# EAGLE design LooSensorNodeV2 (EAGLE 8.7.0)

## Sheet 1 of 3
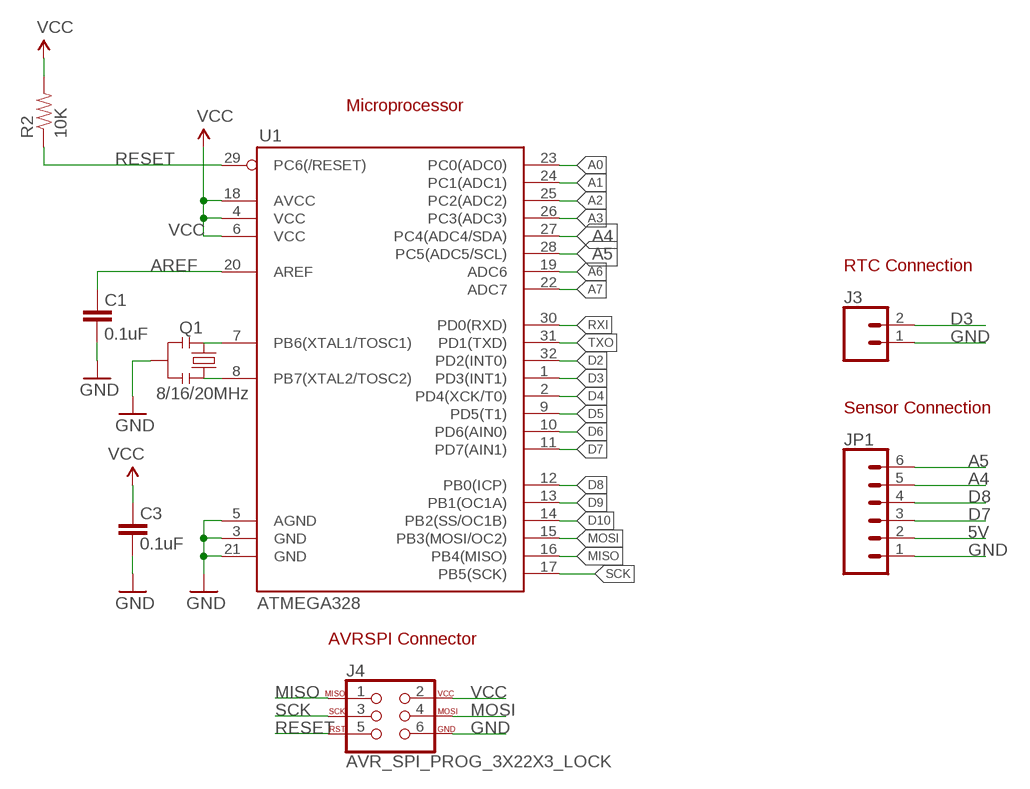
[diagram p0: schematic, sheet 1]

### Parts
C1  0.1uF  CAP0603-CAP  [0603-CAP]
C3  0.1uF  CAP0603-CAP  [0603-CAP]
J3  CONN_02  [1X02]
J4  AVR_SPI_PROG_3X22X3_LOCK  [2X3_LOCK]
JP1  CONN_06SILK_FEMALE_PTH  [1X06]
Q1  8/16/20MHz  RESONATOR1:1  [RESONATOR-SMD-1:1]
R2  10K  RESISTOR0603-RES  [0603-RES]
U1  ATMEGA328  ATMEGA168  [TQFP32-08]

### Nets
5V: JP1.2 ; also sheet 2
A0: U1.23(PC0(ADC0))
A1: U1.24(PC1(ADC1))
A2: U1.25(PC2(ADC2))
A3: U1.26(PC3(ADC3))
A4: JP1.5 U1.27(PC4(ADC4/SDA))
A5: JP1.6 U1.28(PC5(ADC5/SCL))
A6: U1.19(ADC6)
A7: U1.22(ADC7)
AREF: C1.2 U1.20(AREF)
D2: U1.32(PD2(INT0))
D3: J3.2 U1.1(PD3(INT1))
D4: U1.2(PD4(XCK/T0)) ; also sheet 3
D5: U1.9(PD5(T1))
D6: U1.10(PD6(AIN0)) ; also sheet 2
D7: JP1.3 U1.11(PD7(AIN1))
D8: JP1.4 U1.12(PB0(ICP))
D9: U1.13(PB1(OC1A))
D10: U1.14(PB2(SS/OC1B))
GND [vcc]: C1.1 C3.1 J3.1 J4.6 JP1.1 Q1.2 U1.3(GND) U1.5(AGND) U1.21(GND) ; also sheet 2,3
MISO: J4.1 U1.16(PB4(MISO))
MOSI: J4.4 U1.15(PB3(MOSI/OC2))
N$1: Q1.3 U1.8(PB7(XTAL2/TOSC2))
N$2: Q1.1 U1.7(PB6(XTAL1/TOSC1))
RESET: J4.5 R2.1 U1.29(PC6(/RESET))
RXI: U1.30(PD0(RXD)) ; also sheet 3
SCK: J4.3 U1.17(PB5(SCK))
TXO: U1.31(PD1(TXD)) ; also sheet 3
VCC: C3.2 J4.2 R2.2 U1.4(VCC) U1.6(VCC) U1.18(AVCC) ; also sheet 2

### Notes on the sheet
- Microprocessor
- RTC Connection
- Sensor Connection
- AVRSPI Connector

## Sheet 2 of 3
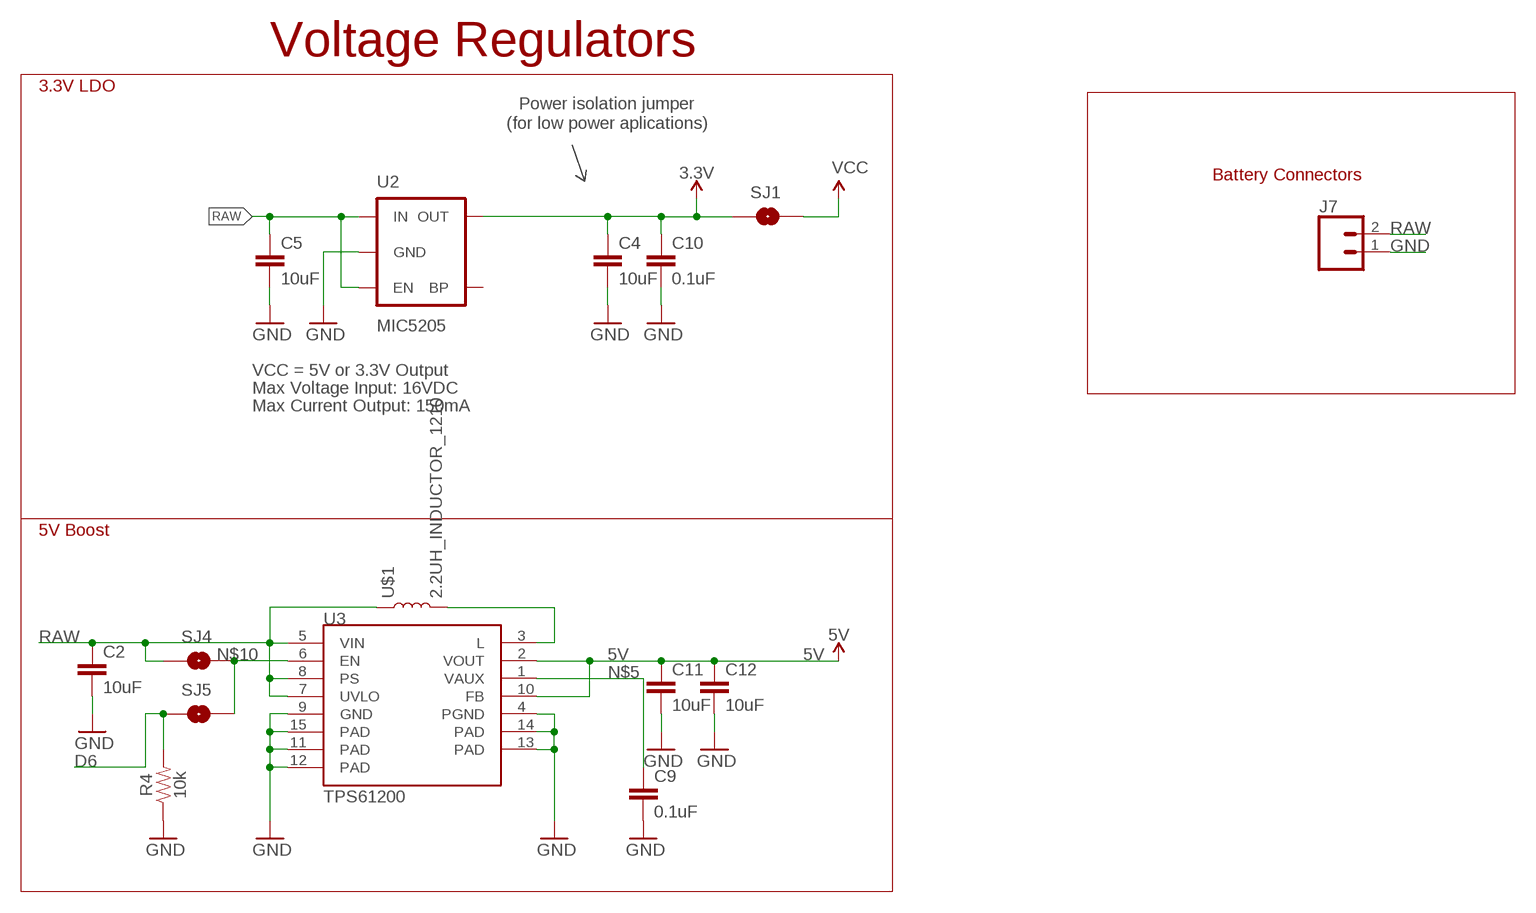
[diagram p1: schematic, sheet 2]

### Parts
C2  10uF  10UF-0603-6.3V-20%  [0603]
C4  10uF  10UF-0603-6.3V-20%  [0603]
C5  10uF  10UF-0603-6.3V-20%  [0603]
C9  0.1uF  0.1UF-0603-25V-5%  [0603]
C10  0.1uF  CAP0603-CAP  [0603-CAP]
C11  10uF  10UF-0603-6.3V-20%  [0603]
C12  10uF  10UF-0603-6.3V-20%  [0603]
J7  CONN_02  [1X02]
R4  10k  10KOHM-0603-1/10W-1%  [0603]
SJ1  SOLDERJUMPERNC  [SJ_2S]
SJ4  SOLDERJUMPERNC  [SJ_2S]
SJ5  SOLDERJUMPERNC  [SJ_2S]
U2  MIC5205  V_REG_LDOSMD  [SOT23-5]
U3  TPS61200  [QFN-10_PAD]
U$1  2.2UH_INDUCTOR_1210  [1210]

### Nets
3.3V: C4.1 C10.1 SJ1.1 U2.5(OUT) ; also sheet 3
5V: C11.1 C12.1 U3.2(VOUT) U3.10(FB) ; also sheet 1
D6: R4.2 SJ5.1 ; also sheet 1
GND [vcc]: C2.2 C4.2 C5.2 C9.2 C10.2 C11.2 C12.2 J7.1 R4.1 U2.2(GND) U3.4(PGND) U3.9(GND) U3.11(PAD) U3.12(PAD) U3.13(PAD) U3.14(PAD) U3.15(PAD) ; also sheet 1,3
N$5: C9.1 U3.1(VAUX)
N$8: U3.3(L) U$1.2
N$10: SJ4.2 SJ5.2 U3.6(EN)
RAW [vcc]: C2.1 C5.1 J7.2 SJ4.1 U2.1(IN) U2.3(EN) U3.5(VIN) U3.7(UVLO) U3.8(PS) U$1.1
VCC: SJ1.2 ; also sheet 1
Unconnected: U2.4(BP)

### Notes on the sheet
- Voltage Regulators
- 3.3V LDO
- Power isolation jumper
- (for low power aplications)
- Battery Connectors
- VCC = 5V or 3.3V Output
- Max Voltage Input: 16VDC
- Max Current Output: 150mA
- 5V Boost

## Sheet 3 of 3
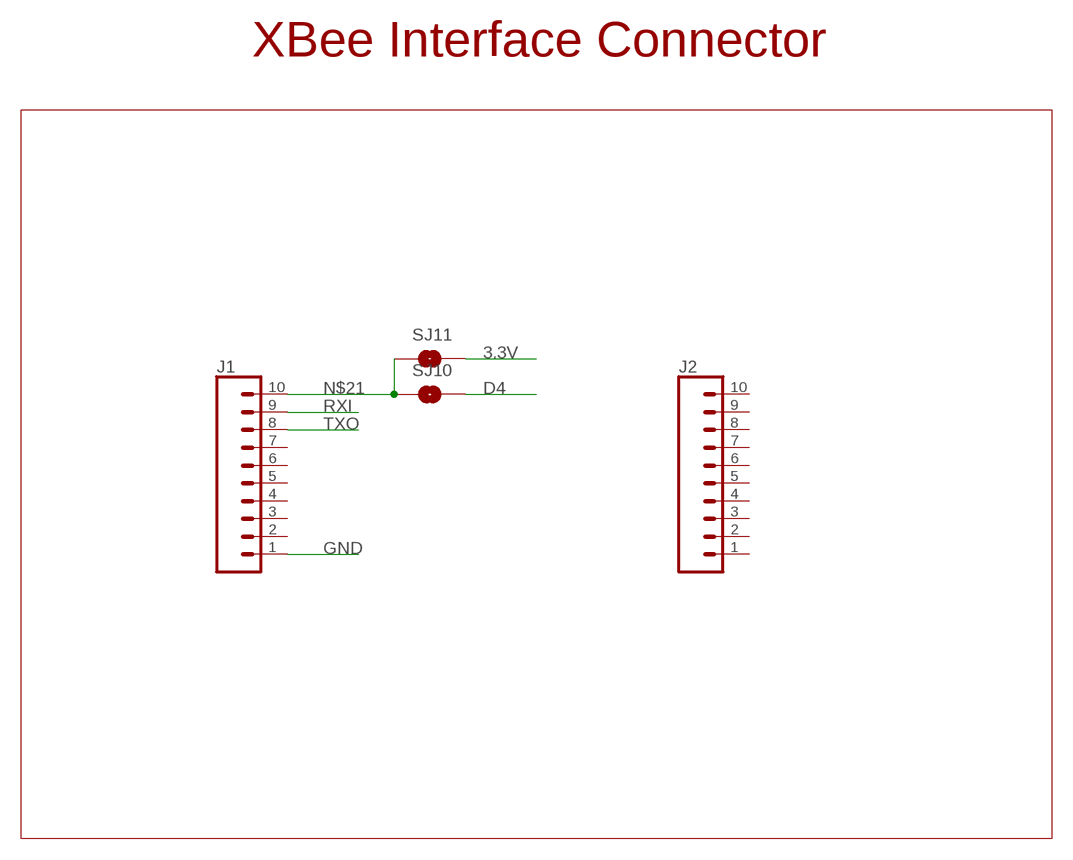
[diagram p2: schematic, sheet 3]

### Parts
J1  CONN_102MM  [1X10-2MM]
J2  CONN_102MM  [1X10-2MM]
SJ10  SOLDERJUMPERNC  [SJ_2S]
SJ11  SOLDERJUMPERNC  [SJ_2S]

### Nets
3.3V: SJ11.2 ; also sheet 2
D4: SJ10.2 ; also sheet 1
GND [vcc]: J1.1 ; also sheet 1,2
N$21: J1.10 SJ10.1 SJ11.1
RXI: J1.9 ; also sheet 1
TXO: J1.8 ; also sheet 1
Unconnected: J1.2 J1.3 J1.4 J1.5 J1.6 J1.7 J2.1 J2.2 J2.3 J2.4 J2.5 J2.6 J2.7 J2.8 J2.9 J2.10

### Notes on the sheet
- XBee Interface Connector

## Library data of the parts
C1 C3 C10 = SparkFun:CAP: Capacitor Standard 0603 ceramic capacitor, and 0.1" leaded capacitor.
C2 C4 C5 C11 C12 = SparkFun-Capacitors:10UF: 10.0µF ceramic capacitors A capacitor is a passive two-terminal electrical component used to store electrical energy temporarily in an electric field.; PROD_ID: CAP-11015
C9 = SparkFun-Capacitors:0.1UF: 0.1µF ceramic capacitors A capacitor is a passive two-terminal electrical component used to store electrical energy temporarily in an electric field.; PROD_ID: CAP-08604
J1 J2 = SparkFun-Connectors:CONN_10: Multi connection point. Often used as Generic Header-pin footprint for 0.1 inch spaced/style header connections On any of the 0.1 inch spaced packages, you can populate with these: Break Away Headers - Straight <https://www.sparkfun.com/products/116> (PRT-00116) Break Away Male Headers - Right Angle <https://www.sparkfun.com/products/553> (PRT-00553) Female Headers <https://www.sparkfun.com/products/115> (PRT-00115) Break Away Headers - Machine Pin <https://www.sparkfun.com/products/117> (PRT-00117) Break Away Female Headers - Swiss Machine Pin <https://www.sparkfun.com/products/743> (PRT-00743) Arduino Stackable Header - 10 Pin <https://www.sparkfun.com/products/11376> (PRT-11376) For SCREWTERMINALS and SPRING TERMINALS visit here: Screw Terimnals on SparkFun.com <https://www.sparkfun.com/search/results?term=Screw+Terminals> (5mm/3.5mm/2.54mm spacing) This device is also useful as a general connection point to wire up your design to another part of your project. Our various solder wires solder well into these plated through hole pads. Hook-Up Wire - Assortment (Stranded, 22 AWG) <https://www.sparkfun.com/products/11375> (PRT-11375) Hook-Up Wire - Assortment (Solid Core, 22 AWG) <https://www.sparkfun.com/products/11367> (PRT-11367) View the entire wire category on our website here <https://www.sparkfun.com/categories/141> Special notes: Molex polarized connector foot print use with SKU : PRT-08231 with associated crimp pins and housings. 1MM SMD Version SKU: PRT-10208 NOTES ON THE VARIANTS LOCK and LOCK_LONGPADS... This footprint was designed to help hold the alignment of a through-hole component (i.e. 6-pin header) while soldering it into place. You may notice that each hole has been shifted either up or down by 0.005 of an inch from it's more standard position (which is a perfectly straight line). This slight alteration caused the pins (the squares in the middle) to touch the edges of the holes. Because they are alternating, it causes a "brace" to hold the component in place. 0.005 has proven to be the perfect amount of "off-center" position when using our standard breakaway headers. Although looks a little odd when you look at the bare footprint, once you have a header in there, the alteration is very hard to notice. Also,if you push a header all the way into place, it is covered up entirely on the bottom side.; PROD_ID: CONN-08875; SF_ID: PRT-08272
J3 J7 = SparkFun-Connectors:CONN_02: Multi connection point. Often used as Generic Header-pin footprint for 0.1 inch spaced/style header connections On any of the 0.1 inch spaced packages, you can populate with these: Break Away Headers - Straight <https://www.sparkfun.com/products/116> (PRT-00116) Break Away Male Headers - Right Angle <https://www.sparkfun.com/products/553> (PRT-00553) Female Headers <https://www.sparkfun.com/products/115> (PRT-00115) Break Away Headers - Machine Pin <https://www.sparkfun.com/products/117> (PRT-00117) Break Away Female Headers - Swiss Machine Pin <https://www.sparkfun.com/products/743> (PRT-00743) For SCREWTERMINALS and SPRING TERMINALS visit here: Screw Terimnals on SparkFun.com <https://www.sparkfun.com/search/results?term=Screw+Terminals> (5mm/3.5mm/2.54mm spacing) This device is also useful as a general connection point to wire up your design to another part of your project. Our various solder wires solder well into these plated through hole pads. Hook-Up Wire - Assortment (Stranded, 22 AWG) <https://www.sparkfun.com/products/11375> (PRT-11375) Hook-Up Wire - Assortment (Solid Core, 22 AWG) <https://www.sparkfun.com/products/11367> (PRT-11367) View the entire wire category on our website here <https://www.sparkfun.com/categories/141> Special notes: Molex polarized connector foot print use with: PRT-08233 with associated crimp pins and housings. 2.54_SCREWTERM for use with PRT-10571. 3.5mm Screw Terminal footprints for PRT-08084 5mm Screw Terminal footprints for use with PRT-08432
J4 = SparkFun-Connectors:AVR_SPI_PROG_3X2: AVR ISP 6 Pin This is the reduced ISP connector for AVR programming. Common on Arduino. This footprint will take up less PCB space and can be used with a 10-pin to 6-pin adapter such as SKU: BOB-08508 **Special note about "TEST_POINT" package. The stop mask is on the top side, so if you want your programming test points to be on the bottom of your board, make sure to place this package on the bottom side of the board. This also ensure that the orientation to program from the bottom side will be correct. SparkFun Products: SparkFun ISP Pogo Adapter <https://www.sparkfun.com/products/11591> - NS Tiny AVR Programmer <https://www.sparkfun.com/products/11801> -PTH
JP1 = SparkFun-Connectors:CONN_06: Multi connection point. Often used as Generic Header-pin footprint for 0.1 inch spaced/style header connections On any of the 0.1 inch spaced packages, you can populate with these: Break Away Headers - Straight <https://www.sparkfun.com/products/116> (PRT-00116) Break Away Male Headers - Right Angle <https://www.sparkfun.com/products/553> (PRT-00553) Female Headers <https://www.sparkfun.com/products/115> (PRT-00115) Break Away Headers - Machine Pin <https://www.sparkfun.com/products/117> (PRT-00117) Break Away Female Headers - Swiss Machine Pin <https://www.sparkfun.com/products/743> (PRT-00743) Arduino Stackable Header - 6 Pin <https://www.sparkfun.com/products/9280> (PRT-09280) For SCREWTERMINALS and SPRING TERMINALS visit here: Screw Terimnals on SparkFun.com <https://www.sparkfun.com/search/results?term=Screw+Terminals> (5mm/3.5mm/2.54mm spacing) This device is also useful as a general connection point to wire up your design to another part of your project. Our various solder wires solder well into these plated through hole pads. Hook-Up Wire - Assortment (Stranded, 22 AWG) <https://www.sparkfun.com/products/11375> (PRT-11375) Hook-Up Wire - Assortment (Solid Core, 22 AWG) <https://www.sparkfun.com/products/11367> (PRT-11367) View the entire wire category on our website here <https://www.sparkfun.com/categories/141>; PROD_ID: CONN-08437
Q1 = Testing:RESONATOR: Resonator Small SMD resonator. This is the itty bitty 10/20MHz resonators with built in caps. CSTCE10M0G55 and CSTCE20M0V53. Footprint for SMD has been used in SFE production for years, and does work okay. 1:1 is an attempt to get larger fillets on the sides so it will be easier to inspect these solders in our AOI machine. The pads have been minimized to match the actual metal under the resonator. To see this relation, it includes an image import of the bottom side of the component. Imported to scale on layer 200.
R2 = SparkFun:RESISTOR: Resistor Basic schematic elements and footprints for 0603, 1206, and PTH resistors.
R4 = SparkFun-Resistors:10KOHM: 10kΩ resistor A resistor is a passive two-terminal electrical component that implements electrical resistance as a circuit element. Resistors act to reduce current flow, and, at the same time, act to lower voltage levels within circuits. - Wikipedia; PROD_ID: RES-00824
SJ1 SJ4 SJ5 SJ10 SJ11 = SparkFun-Passives:SOLDERJUMPER: Solder Jumper Standard SMD solder jumper. Used to automate production. Two varients : Normally Open and Normally Closed are the same, but have different paste layers. NC will have a large amount of paste and should jumper during reflow.
U1 = SparkFun:ATMEGA168
U2 = SparkFun:V_REG_LDO: Voltage Regulator LDO Standard 150mA LDO voltage regulator in SOT-23 layout. Micrel part MIC5205. BP (by-pass) pin is used to lower output noise with 470pF cap.
U3 = SparkFun-IC-Power:TPS61200: DC to DC Booster IC-10035; PROD_ID: IC-10035
U$1 = Loo:2.2UH_INDUCTOR_1210

## Net classes
0 default: width 0.203 mm
1 vcc: width 0.254 mm

## Board
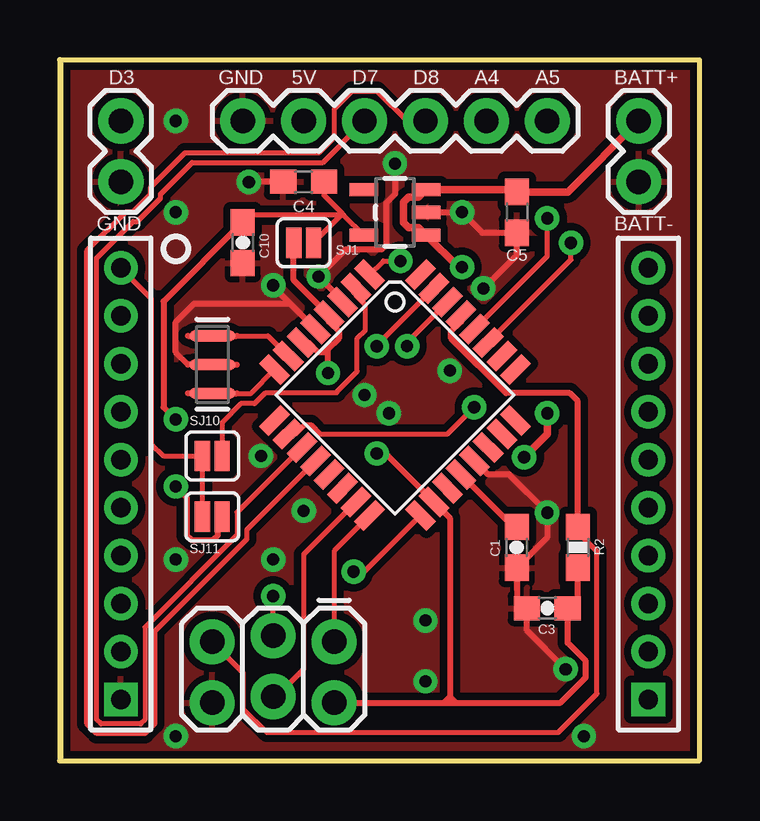
[diagram p3: board, top side]
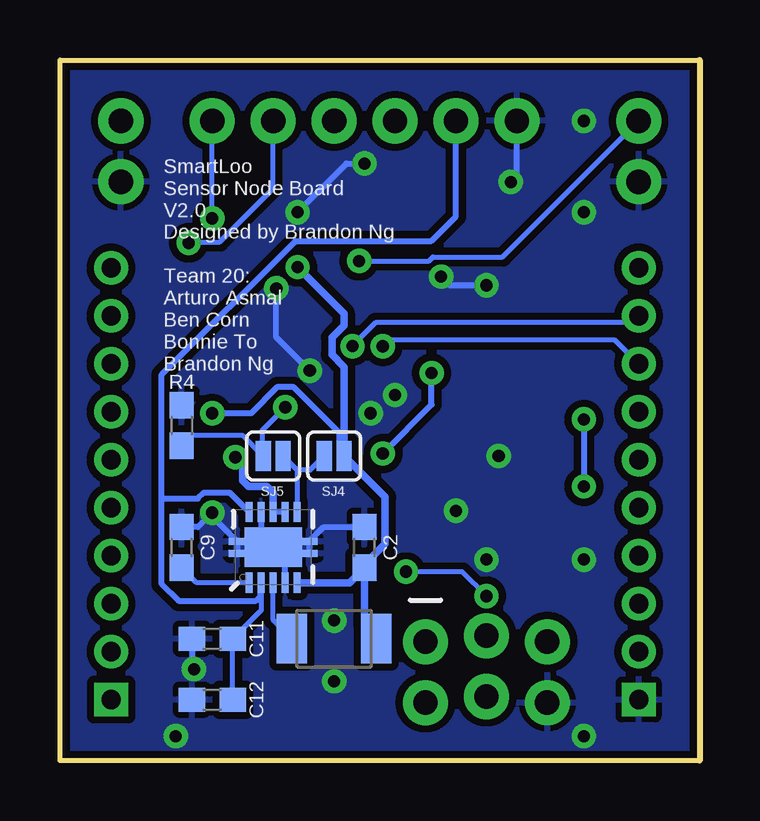
[diagram p4: board, bottom side, seen from below]

Size 26.67 x 29.21 mm. Coordinates in mm from the lower left corner, seen from the top.
Outline: 0,0 26.67,0 26.67,29.21 0,29.21 0,0
Copper layers (1*16): Top 0.035mm / dielectric 1.5mm / Bottom 0.035mm
Design rules "SparkFun-2-layer *": minimum track width 7mil, minimum drill 15mil, track to track 8mil, track to pad 8mil, pad to pad 8mil, via to via 8mil, smd to smd 8mil, copper to edge 8mil, drill to drill 8mil, minimum pad ring 12mil, minimum via ring 10mil, stop-mask expansion 4mil, vias tented up to drill 20mil, thermal gap 10mil

### Footprints (pad centres in the part's own frame; a part is rotated, then mirrored left to right if it is on the bottom)
0603-CAP = smd 1.1 x 1: 1 -0.85,0; 2 0.85,0
0603 = smd 1.1 x 1: 1 -0.85,0; 2 0.85,0
1X10-2MM = drill 0.8 square: 1 0,0 | drill 0.8: 2 2,0; 3 4,0; 4 6,0; 5 8,0; 6 10,0; 7 12,0; 8 14,0; 9 16,0; 10 18,0
1X02 = drill 1.016 pad 1.88: 1 0,0; 2 2.54,0
2X3_LOCK = drill 1.016 pad 1.88: 1 0,0.127; 2 0,2.667; 3 2.54,-0.127; 4 2.54,2.413; 5 5.08,0.127; 6 5.08,2.667
1X06 = drill 1.016 pad 1.88: 1 0,0; 2 2.54,0; 3 5.08,0; 4 7.62,0; 5 10.16,0; 6 12.7,0
RESONATOR-SMD-1:1 = smd 0.45 x 1.905: 1 -1.2,0; 2 0,0; 3 1.2,0
0603-RES = smd 1.1 x 1: 1 -0.85,0; 2 0.85,0
SJ_2S = smd 0.635 x 1.27: 1 -0.412,0; 2 0.412,0
TQFP32-08 = smd 1.27 x 0.559: 1 -4.293,2.8; 2 -4.293,2; 3 -4.293,1.2; 4 -4.293,0.4; 5 -4.293,-0.4; 6 -4.293,-1.2; 7 -4.293,-2; 8 -4.293,-2.8; 17 4.293,-2.8; 18 4.293,-2; 19 4.293,-1.2; 20 4.293,-0.4; 21 4.293,0.4; 22 4.293,1.2; 23 4.293,2; 24 4.293,2.8 | smd 0.559 x 1.27: 9 -2.8,-4.293; 10 -2,-4.293; 11 -1.2,-4.293; 12 -0.4,-4.293; 13 0.4,-4.293; 14 1.2,-4.293; 15 2,-4.293; 16 2.8,-4.293; 25 2.8,4.293; 26 2,4.293; 27 1.2,4.293; 28 0.4,4.293; 29 -0.4,4.293; 30 -1.2,4.293; 31 -2,4.293; 32 -2.8,4.293
SOT23-5 = smd 0.55 x 1.2: 1 -0.95,-1.3; 2 0,-1.3; 3 0.95,-1.3; 4 0.95,1.3; 5 -0.95,1.3
QFN-10_PAD = smd 0.297 x 0.85: 1 -1,-1.475; 2 -0.5,-1.475; 3 0,-1.475; 4 0.5,-1.475; 5 1,-1.475; 6 1,1.475; 7 0.5,1.475; 8 0,1.475; 9 -0.5,1.475; 10 -1,1.475 | smd 0.7 x 0.28: 11 -1.5,0.25; 12 -1.5,-0.25; 13 1.5,0.25; 14 1.5,-0.25 | smd 2.4 x 1.65: 15 0,0
1210 = smd 1.27 x 2.06: 1 -1.755,0; 2 1.755,0

### Placement (x,y rotation side)
C1  19.05,8.89 90 top
C2  13.97,8.89 90 bottom
C3  20.32,6.35 0 top
C4  10.16,24.13 180 top
C5  19.05,22.86 270 top
C9  21.59,8.89 90 bottom
C10  7.62,21.59 270 top
C11  20.32,5.08 180 bottom
C12  20.32,2.54 180 bottom
J1  2.54,2.54 90 top
J2  24.54,2.54 90 top
J3  2.54,24.13 90 top
J4  11.43,5.08 180 top
J7  24.13,24.13 90 top
JP1  7.62,26.67 0 top
Q1  6.35,16.51 270 top
R2  21.59,8.89 270 top
R4  21.59,13.97 270 bottom
SJ1  10.16,21.59 180 top
SJ4  15.24,12.7 180 bottom
SJ5  17.78,12.7 0 bottom
SJ10  6.35,12.7 0 top
SJ11  6.35,10.16 0 top
U1  13.97,15.24 315 top
U2  13.97,22.86 90 top
U3  17.78,8.89 0 bottom
U$1  15.24,5.08 180 bottom

### Tracks (layer width: path | path; a pad name or v marks a point on that pad's centre or on a via)
3.3V  (via drill 0.51)
  Top 0.203: C4.1 11.01,23.57 11.7,22.88 | 11.7,22.88 11.83,22.75 | 11.83,22.75 U2.5 | SJ1.1 11.7,22.72 11.7,22.88 | 11.83,22.75 7.93,22.75 C10.1
  Top 0.254: C10.1 4.32,19.14 4.32,14.73 v4.83,14.22 | v4.83,11.43 5.29,10.97 5.29,9.39 5.48,9.2 6.39,9.2 6.59,9.39 6.59,9.98 SJ11.2
  Bottom 0.254: v4.83,14.22 v4.83,11.43
5V
  Bottom 0.203: C12.1 C11.1 18.28,6.27 18.28,7.11 U3.2
  Bottom 0.254: 18.28,7.11 18.3,7.09 18.3,6.85 18.5,6.66 21.73,6.66 22.42,7.35 22.42,10.92 | JP1.2 10.16,22.69 11.18,21.67 16.86,21.67 22.42,16.1 22.42,10.92 | 22.42,10.92 20.92,10.92 20.67,11.18 19.59,11.18 U3.10
A4  (via drill 0.51)
  Top 0.203: U1.27 21.31,20.88 v21.31,21.59
  Bottom 0.203: v21.31,21.59 21.27,21.62 20.02,21.62 17.78,23.85 JP1.5
A5  (via drill 0.51)
  Top 0.203: U1.28 20.32,21.02 v20.32,22.61
  Bottom 0.203: v20.32,22.61 JP1.6
AREF
  Top 0.254: U1.20 18.9,9.74 C1.2
D3  (via drill 0.51)
  Top 0.203: U1.1 13.49,20.83 v14.2,20.83
  Bottom 0.203: v14.2,20.83 11.28,20.83 11.12,20.99 8.22,20.99 J3.2
D4
  Top 0.203: SJ10.2 6.76,14.1 7.54,14.88 8.11,14.88 8.58,15.34 11.43,15.34 11.51,15.34 | U1.2 12.35,19.38 12.73,19 12.73,17.95 12.39,17.61 12.39,16.23 11.51,15.34 | 11.51,15.34 11.53,15.34
D6  (via drill 0.51)
  Top 0.203: v17.27,14.73 16.16,13.62 10.85,13.62 10.46,14.01 10.21,14.01 9.83,13.62 U1.10
  Bottom 0.203: SJ5.1 18.24,12.75 | 18.24,12.75 19.04,13.55 21.16,13.55 R4.2 | v17.27,14.73 18.24,13.76 18.24,12.75
D7
  Top 0.203: U1.11 7.38,10.35 7.38,9.4 3.55,5.56 3.55,1.71 3.37,1.53 1.71,1.53 1.53,1.71 1.53,20.83 1.53,20.96 3.05,22.48 3.22,22.48 4.19,23.45 4.19,23.62 5.5,24.93 10.96,24.93 JP1.3
D8
  Top 0.203: U1.12 7.79,9.63 7.79,9.23 3.96,5.4 3.96,1.54 3.54,1.12 1.54,1.12 1.12,1.54 1.12,21.26 2.75,22.89 3.06,22.89 3.79,23.61 3.79,23.92 5.21,25.34 10.8,25.34 11.46,26 11.46,27.19 12.18,27.91 13.22,27.91 14.46,26.67 JP1.4
GND  (via drill 0.51)
  Top 0.254: Q1.2 5.33,16.51 4.83,17.02 4.83,18.29 5.59,19.05 9.59,19.05 | 9.59,19.05 U1.5 | 9.59,19.05 8.89,19.75 v8.89,19.81 | U1.3 11.78,19.18 v10.78,20.18 11.91,21.3 13.41,21.3 13.6,21.5 13.6,23.25 13.97,23.62 v13.97,24.89 | U2.2 v16.76,22.86 17.61,22.01 C5.2 19.05,21.08 v17.65,19.68 | C4.2 7.88,24.13 v7.87,24.12 | v21.08,3.81 19.47,5.42 C3.1 19.05,6.77 C1.1 20.32,9.31 v20.32,10.34 18.72,11.94 17.84,11.94 U1.21
  Bottom 0.254: U3.13 U3.14 17.28,8.64 | U3.11 U3.12 18.03,8.64 U3.15 | U3.15 18.03,9.14 U3.11 | U3.13 17.53,9.14 17.65,9.02 | 17.65,9.02 U3.15 | U3.4 17.28,8.64 | 17.28,8.64 17.65,9.02 | U3.9 18.28,9.64 17.53,8.89 | U3.11 20.32,10.18 v20.32,10.34 20.92,9.74 C9.2 | U3.13 15.68,9.74 C2.2 | v8.89,19.81 10.41,19.81 v10.78,20.18 | v16.76,22.86 14.73,24.89 v13.97,24.89 | v7.87,24.12 7.62,24.38 JP1.1 | C11.2 21.17,3.9 v21.08,3.81 | v16.26,16.26 17.65,17.65 v17.65,19.68
  other vias: 15.24,3.3 13.72,14.48 12.7,15.24 8.38,12.7 4.83,8.38 15.24,5.84 8.89,8.38 4.83,1.02 21.84,1.02 10.16,10.41 4.83,22.86 4.83,26.67
  pour Top (isolate 0.305): -3.81,34.29 30.23,34.29 30.23,-3.81 -3.81,-3.81
  pour Bottom (isolate 0.305): -5.84,31.24 29.46,31.5 29.46,-2.79 -5.84,-2.54
MISO
  Top 0.203: U1.16 11.43,8.74 J4.1
MOSI
  Top 0.203: U1.15 10.16,8.6 10.16,3.81 9.02,2.67 J4.4
N$1
  Top 0.203: Q1.3 7.97,15.31 U1.8
N$2
  Top 0.203: Q1.1 8.67,17.71 U1.7
N$5
  Bottom 0.203: U3.1 20.96,7.42 C9.1
N$8
  Bottom 0.203: U$1.2 17.78,5.87 U3.3
N$10
  Bottom 0.203: SJ5.2 16.78,12.11 | 16.78,12.11 U3.6 | SJ4.2 16.24,12.11 16.78,12.11
N$21
  Top 0.203: SJ11.1 SJ10.1 4.32,12.7 3.81,13.21 3.81,19.27 J1.10
RAW  (via drill 0.51)
  Top 0.305: J7.2 21.17,23.71 C5.1 18.95,23.81 U2.3 14.95,23.49 14.52,23.49 14.31,23.28 14.31,22.44 14.52,22.23 14.95,22.23 U2.1 16.61,20.57 v16.76,20.57 | v20.32,14.48 20.32,13.62 v19.35,12.65
  Bottom 0.254: U3.7 U3.8 | SJ4.1 15,12.88 15,13.65 16.93,15.57 17.62,15.57 18.71,14.48 v20.32,14.48 | U3.5 16.51,7.42
  Bottom 0.305: U$1.1 13.97,5.57 C2.1 | C2.1 14.6,7.42 16.51,7.42 U3.5 | C2.1 13.97,8.19 13.11,9.04 13.11,10.99 SJ4.1 14.83,16.41 15.34,16.92 15.34,17.64 14.83,18.14 14.83,18.64 v16.76,20.57 | v19.35,12.65 19.05,12.35 19.05,11.68 18.8,11.43 18.03,11.43 17.78,11.18 17.78,10.94 U3.8
RESET
  Top 0.203: J4.5 7.64,3.66 7.64,2.15 8.63,1.17 20.77,1.17 22.39,2.79 22.39,8.72 21.59,9.52 R2.1
  Top 0.254: U1.29 16.72,18.29 16.31,17.88 16.31,17.6 18.6,15.32 21.26,15.32 21.59,14.99 R2.1
RXI  (via drill 0.51)
  Top 0.203: 16.06,19.12 U1.30 14.47,17.44 v14.47,17.28
  Bottom 0.203: J1.9 2.82,18.26 13.51,18.26 14.47,17.3 v14.47,17.28
SCK  (via drill 0.51)
  Top 0.203: J4.3 v8.89,6.86 | v12.24,7.87 12.68,7.87 U1.17
  Bottom 0.203: v8.89,6.86 9.91,7.87 v12.24,7.87
TXO  (via drill 0.51)
  Top 0.203: U1.31 13.21,17.31 v13.21,17.27
  Bottom 0.203: J1.8 3.53,17.53 12.95,17.53 v13.21,17.27
VCC  (via drill 0.51)
  Top 0.254: 11.22,18.58 U1.4 | 11.18,17.15 11.63,17.6 11.63,17.88 11.22,18.29 U1.4 | 11.18,17.15 11.04,17.02 10.77,17.02 10.36,17.43 U1.6 | U1.4 9.75,20.03 SJ1.2 | 20.99,6.35 C3.2 | C3.2 21.59,6.77 R2.2 | v13.21,12.81 13.57,12.81 U1.18 16.26,10.13 16.26,2.67 | v11.18,16.16 11.18,17.15 | C3.2 21.17,4.91 21.92,4.16 21.92,3.46 20.87,2.41 16.51,2.41 | J4.2 16,2.41 | 16,2.41 16.26,2.41 | 16.26,2.41 16.51,2.41 | 16.26,2.67 16.26,2.41 | 16.26,2.67 16.51,2.41 | 16.26,2.67 16,2.41
  Bottom 0.254: v13.21,12.81 11.18,14.84 v11.18,16.16

### Text on the board
tPlace: D3 | GND | 5V | D7 | D8 | A4 | A5 | BATT+ | GND | BATT-
bPlace: SmartLoo / Sensor Node Board / V2.0 / Designed by Brandon Ng / / Team 20: / Arturo Asmal / Ben Corn / Bonnie To / Brandon Ng